# EAGLE design compressor (EAGLE 9.6.2)
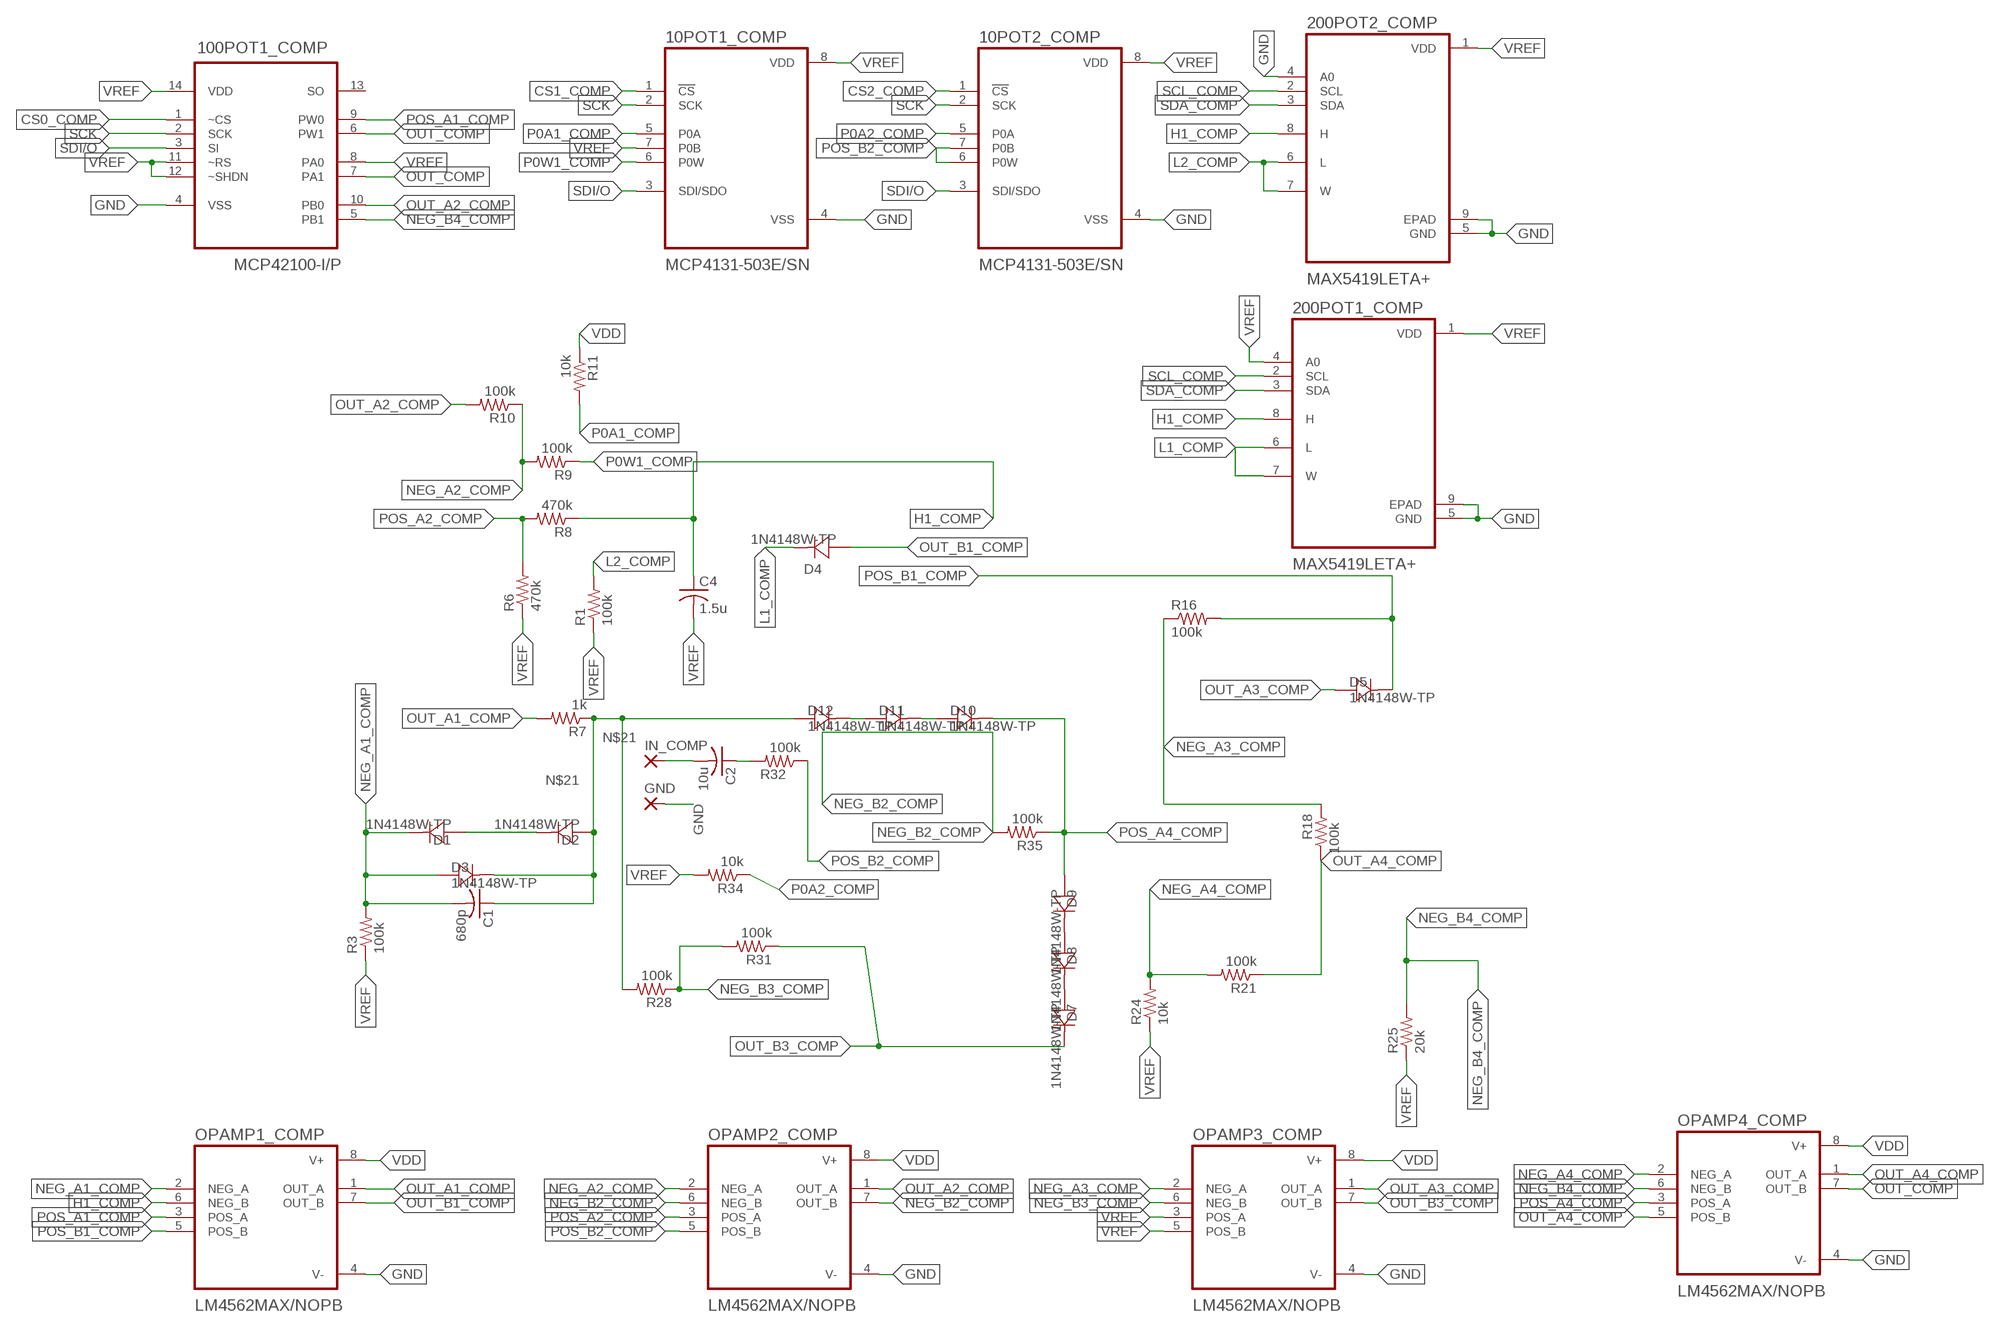
[diagram p0: schematic, sheet 1]

## Parts
10POT1_COMP  MCP4131-503E/SN  [SOIC127P599X175-8N]
10POT2_COMP  MCP4131-503E/SN  [SOIC127P599X175-8N]
100POT1_COMP  MCP42100-I/P  [DIP254P762X432-14]
200POT1_COMP  MAX5419LETA+  [SON65P300X300X80-9N]
200POT2_COMP  MAX5419LETA+  [SON65P300X300X80-9N]
C1  680p  C-USC0402  [C0402]
C2  10u  C-USC0402  [C0402]
C4  1.5u  C-USC0402  [C0402]
D1  1N4148W-TP  [SOD123]
D2  1N4148W-TP  [SOD123]
D3  1N4148W-TP  [SOD123]
D4  1N4148W-TP  [SOD123]
D5  1N4148W-TP  [SOD123]
D7  1N4148W-TP  [SOD123]
D8  1N4148W-TP  [SOD123]
D9  1N4148W-TP  [SOD123]
D10  1N4148W-TP  [SOD123]
D11  1N4148W-TP  [SOD123]
D12  1N4148W-TP  [SOD123]
GND  SMD5  [SMD2,54-5,08]
IN_COMP  SMD5  [SMD2,54-5,08]
OPAMP1_COMP  LM4562MAX/NOPB  [SOIC127P599X175-8N]
OPAMP2_COMP  LM4562MAX/NOPB  [SOIC127P599X175-8N]
OPAMP3_COMP  LM4562MAX/NOPB  [SOIC127P599X175-8N]
OPAMP4_COMP  LM4562MAX/NOPB  [SOIC127P599X175-8N]
R1  100k  R-US_R0402  [R0402]
R3  100k  R-US_R0402  [R0402]
R6  470k  R-US_R0402  [R0402]
R7  1k  R-US_R0402  [R0402]
R8  470k  R-US_R0402  [R0402]
R9  100k  R-US_R0402  [R0402]
R10  100k  R-US_R0402  [R0402]
R11  10k  R-US_R0402  [R0402]
R16  100k  R-US_R0402  [R0402]
R18  100k  R-US_R0402  [R0402]
R21  100k  R-US_R0402  [R0402]
R24  10k  R-US_R0402  [R0402]
R25  20k  R-US_R0402  [R0402]
R28  100k  R-US_R0402  [R0402]
R31  100k  R-US_R0402  [R0402]
R32  100k  R-US_R0402  [R0402]
R34  10k  R-US_R0402  [R0402]
R35  100k  R-US_R0402  [R0402]

## Nets
CS0_COMP: 100POT1_COMP.1(~CS)
CS1_COMP: 10POT1_COMP.1(!CS)
CS2_COMP: 10POT2_COMP.1(!CS)
GND: 10POT1_COMP.4(VSS) 10POT2_COMP.4(VSS) 100POT1_COMP.4(VSS) 200POT1_COMP.5(GND) 200POT1_COMP.9(EPAD) 200POT2_COMP.4(A0) 200POT2_COMP.5(GND) 200POT2_COMP.9(EPAD) GND.1(P) OPAMP1_COMP.4(V-) OPAMP2_COMP.4(V-) OPAMP3_COMP.4(V-) OPAMP4_COMP.4(V-)
H1_COMP: 200POT1_COMP.8(H) 200POT2_COMP.8(H) C4.1 OPAMP1_COMP.6(NEG_B) R8.1
IN_COMP: C2.2 IN_COMP.1(P)
L1_COMP: 200POT1_COMP.6(L) 200POT1_COMP.7(W) D4.C
L2_COMP: 200POT2_COMP.6(L) 200POT2_COMP.7(W) R1.2
N$20: D1.A D2.C
N$21: C1.1 D2.A D3.C D12.A R7.1 R28.2
N$24: D8.A D9.C
N$25: D7.A D8.C
N$30: C2.1 R32.2
N$31: D11.A D12.C
N$32: D10.A D11.C
NEG_A1_COMP: C1.2 D1.C D3.A OPAMP1_COMP.2(NEG_A) R3.2
NEG_A2_COMP: OPAMP2_COMP.2(NEG_A) R9.2 R10.1
NEG_A3_COMP: OPAMP3_COMP.2(NEG_A) R16.1 R18.2
NEG_A4_COMP: OPAMP4_COMP.2(NEG_A) R21.2 R24.2
NEG_B2_COMP: OPAMP2_COMP.6(NEG_B) OPAMP2_COMP.7(OUT_B) R35.2
NEG_B3_COMP: OPAMP3_COMP.6(NEG_B) R28.1 R31.2
NEG_B4_COMP: 100POT1_COMP.5(PB1) OPAMP4_COMP.6(NEG_B) R25.2
OUT_A1_COMP: OPAMP1_COMP.1(OUT_A) R7.2
OUT_A2_COMP: 100POT1_COMP.10(PB0) OPAMP2_COMP.1(OUT_A) R10.2
OUT_A3_COMP: D5.A OPAMP3_COMP.1(OUT_A)
OUT_A4_COMP: OPAMP4_COMP.1(OUT_A) OPAMP4_COMP.5(POS_B) R18.1 R21.1
OUT_B1_COMP: D4.A OPAMP1_COMP.7(OUT_B)
OUT_B3_COMP: D7.C OPAMP3_COMP.7(OUT_B) R31.1
OUT_COMP: 100POT1_COMP.6(PW1) 100POT1_COMP.7(PA1) OPAMP4_COMP.7(OUT_B)
P0A1_COMP: 10POT1_COMP.5(P0A) R11.2
P0A2_COMP: 10POT2_COMP.5(P0A) R34.1
P0W1_COMP: 10POT1_COMP.6(P0W) R9.1
POS_A1_COMP: 100POT1_COMP.9(PW0) OPAMP1_COMP.3(POS_A)
POS_A2_COMP: OPAMP2_COMP.3(POS_A) R6.2 R8.2
POS_A4_COMP: D9.A D10.C OPAMP4_COMP.3(POS_A) R35.1
POS_B1_COMP: D5.C OPAMP1_COMP.5(POS_B) R16.2
POS_B2_COMP: 10POT2_COMP.6(P0W) 10POT2_COMP.7(P0B) OPAMP2_COMP.5(POS_B) R32.1
SCK: 10POT1_COMP.2(SCK) 10POT2_COMP.2(SCK) 100POT1_COMP.2(SCK)
SCL_COMP: 200POT1_COMP.2(SCL) 200POT2_COMP.2(SCL)
SDA_COMP: 200POT1_COMP.3(SDA) 200POT2_COMP.3(SDA)
SDI/O: 10POT1_COMP.3(SDI/SDO) 10POT2_COMP.3(SDI/SDO) 100POT1_COMP.3(SI)
VDD: OPAMP1_COMP.8(V+) OPAMP2_COMP.8(V+) OPAMP3_COMP.8(V+) OPAMP4_COMP.8(V+) R11.1
VREF: 10POT1_COMP.7(P0B) 10POT1_COMP.8(VDD) 10POT2_COMP.8(VDD) 100POT1_COMP.8(PA0) 100POT1_COMP.11(~RS) 100POT1_COMP.12(~SHDN) 100POT1_COMP.14(VDD) 200POT1_COMP.1(VDD) 200POT1_COMP.4(A0) 200POT2_COMP.1(VDD) C4.2 OPAMP3_COMP.3(POS_A) OPAMP3_COMP.5(POS_B) R1.1 R3.1 R6.1 R24.1 R25.1 R34.2
Unconnected: 100POT1_COMP.13(SO)

## Library data of the parts
10POT1_COMP 10POT2_COMP = MCP4131-503E_SN:MCP4131-503E/SN: Check availability <https://pricing.snapeda.com/parts/MCP4131-503E/SN/Microchip/view-part?ref=eda>; AVAILABILITY: In Stock; CHECK_PRICES: https://www.snapeda.com/parts/MCP4131-503E/SN/Microchip/view-part/?ref=eda; DESCRIPTION: MCP4131-503E/SN,Digi Potentiometer 50kOhm 129-Pos Linear Serial-SPI 8-Pin SOIC | Microchip Technology Inc. MCP4131-503E/SN; MF: Microchip; MP: MCP4131-503E/SN; PACKAGE: SOIC-8 Microchip; PRICE: None; PURCHASE-URL: https://www.snapeda.com/api/url_track_click_mouser/?unipart_id=129576&manufacturer=Microchip&part_name=MCP4131-503E/SN&search_term=mcp413; SNAPEDA_LINK: https://www.snapeda.com/parts/MCP4131-503E/SN/Microchip/view-part/?ref=snap
100POT1_COMP = MCP42100-I_P:MCP42100-I/P: Digital Potentiometer Check availability <https://pricing.snapeda.com/parts/MCP42100-I/P/Microchip/view-part?ref=eda>; AVAILABILITY: In Stock; CHECK_PRICES: https://www.snapeda.com/parts/MCP42100-I/P/Microchip/view-part/?ref=eda; DESCRIPTION: Pot,Digital;Rest 100 Kilohms;Digital;256 Pos;14 Pins;2 Ch;Pkg DIP | Microchip Technology Inc. MCP42100-I/P; MF: Microchip; MP: MCP42100-I/P; PACKAGE: DIP-14 Microchip; PRICE: None; PURCHASE-URL: https://www.snapeda.com/api/url_track_click_mouser/?unipart_id=40874&manufacturer=Microchip&part_name=MCP42100-I/P&search_term=mcp42100; SNAPEDA_LINK: https://www.snapeda.com/parts/MCP42100-I/P/Microchip/view-part/?ref=snap
200POT1_COMP 200POT2_COMP = MAX5419LETA_:MAX5419LETA+: Check availability <https://pricing.snapeda.com/parts/MAX5419LETA%2B/Analog%20Devices/view-part?ref=eda>; AVAILABILITY: In Stock; CHECK_PRICES: https://www.snapeda.com/parts/MAX5419LETA+/Analog+Devices/view-part/?ref=eda; DESCRIPTION: 256-Tap, Nonvolatile, I²C-Interface, Digital Potentiometers; MF: Analog Devices; MP: MAX5419LETA+; PACKAGE: TDFN-EP-8 Maxim; PRICE: None; PURCHASE-URL: https://www.snapeda.com/api/url_track_click_mouser/?unipart_id=895758&manufacturer=Analog Devices&part_name=MAX5419LETA+&search_term=max541; SNAPEDA_LINK: https://www.snapeda.com/parts/MAX5419LETA+/Analog+Devices/view-part/?ref=snap
C1 C2 C4 = rcl:C-US: CAPACITOR, American symbol; SPICEPREFIX: C
D1-D5 D7-D12 = 1N4148W-TP:1N4148W-TP: Check availability <https://pricing.snapeda.com/parts/1N4148W-TP/Micro%20Commercial/view-part?ref=eda>; AVAILABILITY: In Stock; CHECK_PRICES: https://www.snapeda.com/parts/1N4148W-TP/Micro+Commercial+Components/view-part/?ref=eda; DESCRIPTION: 1N4148W Series 100 V 150 mA 4 ns SMT High Speed Switching Diode - SOD-123; MF: Micro Commercial; MP: 1N4148W-TP; PACKAGE: SOD-123 Multicomp; PRICE: None; PURCHASE-URL: https://www.snapeda.com/api/url_track_click_mouser/?unipart_id=9224&manufacturer=Micro Commercial&part_name=1N4148W-TP&search_term=1n4148 surface mount; SNAPEDA_LINK: https://www.snapeda.com/parts/1N4148W-TP/Micro+Commercial+Components/view-part/?ref=snap
GND IN_COMP = wirepad:SMD5: SMD PAD
OPAMP1_COMP OPAMP2_COMP OPAMP3_COMP OPAMP4_COMP = LM4562MAX_NOPB:LM4562MAX/NOPB: Check availability <https://pricing.snapeda.com/parts/LM4562MAX/NOPB/Texas%20Instruments/view-part?ref=eda>; AVAILABILITY: In Stock; CHECK_PRICES: https://www.snapeda.com/parts/LM4562MAX/NOPB/Texas+Instruments/view-part/?ref=eda; DESCRIPTION: 2-channel, 55-MHz, high-fidelity, high performance audio op amp; MF: Texas Instruments; MP: LM4562MAX/NOPB; PACKAGE: SOIC-8 Texas Instruments; PRICE: None; PURCHASE-URL: https://www.snapeda.com/api/url_track_click_mouser/?unipart_id=21165&manufacturer=Texas Instruments&part_name=LM4562MAX/NOPB&search_term=lm4562; SNAPEDA_LINK: https://www.snapeda.com/parts/LM4562MAX/NOPB/Texas+Instruments/view-part/?ref=snap
R1 R3 R6-R11 R16 R18 R21 R24 R25 R28 R31 R32 R34 R35 = rcl:R-US_: RESISTOR, American symbol; SPICEPREFIX: R

## Board
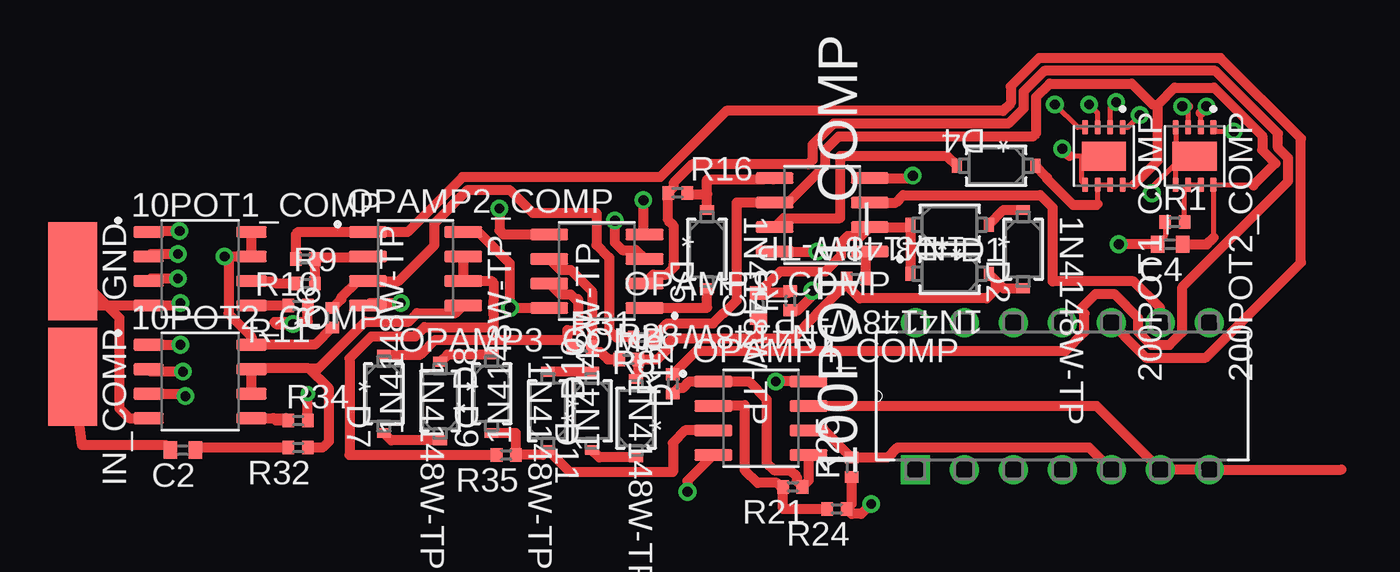
[diagram p1: board, top side]
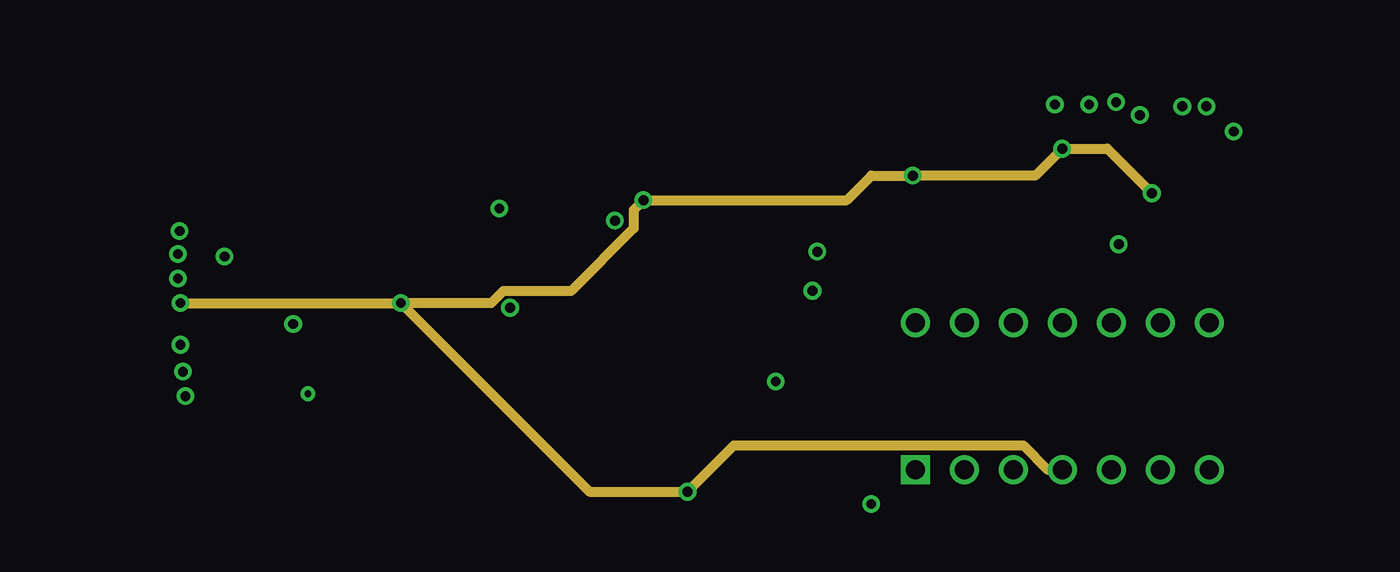
[diagram p2: board, inner layer Route2]
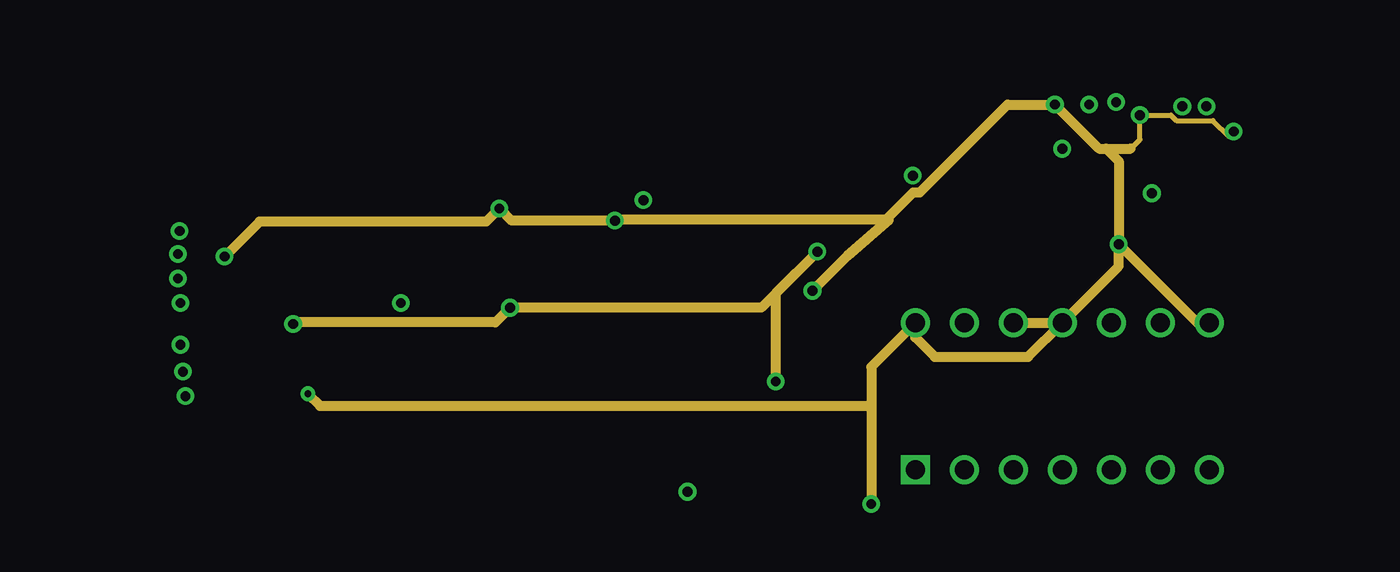
[diagram p3: board, inner layer Route15]
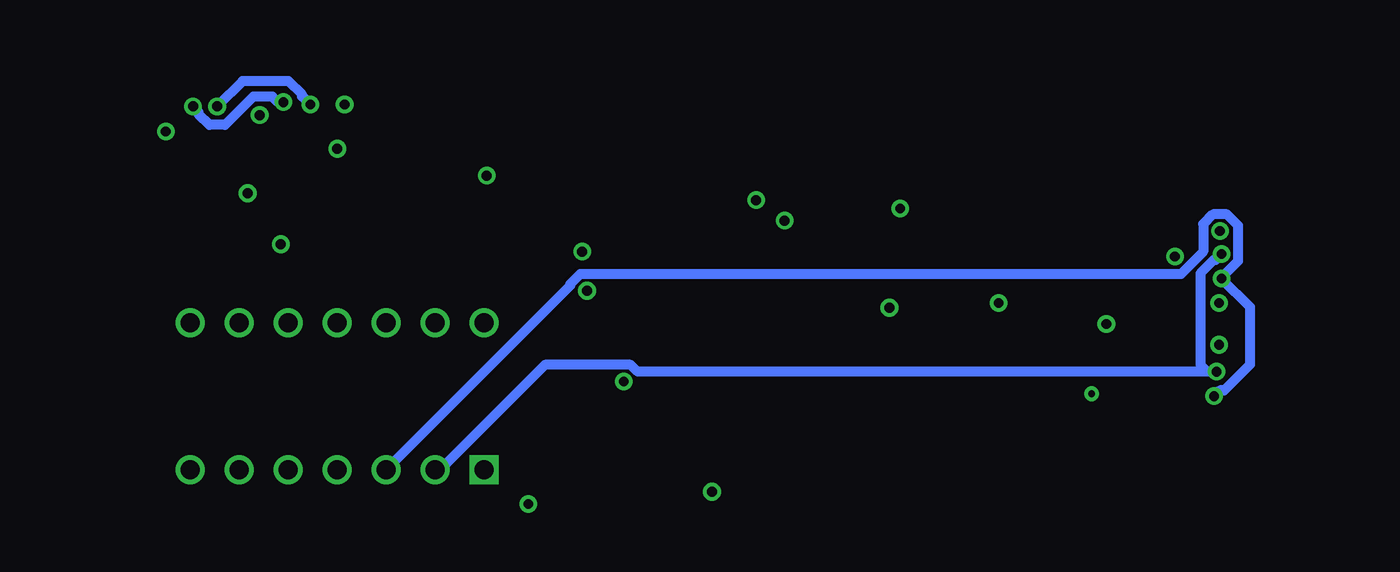
[diagram p4: board, bottom side, seen from below]

No outline drawn. Coordinates in mm, seen from the top.
Copper layers (1+2*15+16): Top 0.035mm / dielectric 1.5mm / Route2 0.035mm / dielectric 0.15mm / Route15 0.035mm / dielectric 0.2mm / Bottom 0.035mm
Design rules "default *": minimum track width 6mil, minimum drill 0.35mm, track to track 6mil, track to pad 6mil, pad to pad 6mil, via to via 6mil, smd to smd 6mil, copper to edge 40mil, drill to drill 6mil, minimum pad ring 10mil, minimum via ring 8mil, stop-mask expansion 4mil, vias tented up to drill 0mil, thermal gap 10mil

### Footprints (pad centres in the part's own frame; a part is rotated, then mirrored left to right if it is on the bottom)
SOIC127P599X175-8N = smd 1.58 x 0.6: 1 -2.67,1.905; 2 -2.67,0.635; 3 -2.67,-0.635; 4 -2.67,-1.905; 5 2.67,-1.905; 6 2.67,-0.635; 7 2.67,0.635; 8 2.67,1.905
DIP254P762X432-14 = drill 0.991 square: 1 -7.62,15.24 | drill 0.991: 2 -7.62,12.7; 3 -7.62,10.16; 4 -7.62,7.62; 5 -7.62,5.08; 6 -7.62,2.54; 7 -7.62,0; 8 0,0; 9 0,2.54; 10 0,5.08; 11 0,7.62; 12 0,10.16; 13 0,12.7; 14 0,15.24
SON65P300X300X80-9N = smd 0.76 x 0.32: 1 -1.485,0.975; 2 -1.485,0.325; 3 -1.485,-0.325; 4 -1.485,-0.975; 5 1.485,-0.975; 6 1.485,-0.325; 7 1.485,0.325; 8 1.485,0.975 | smd 1.5 x 2.3: 9 0,0
C0402 = smd 0.7 x 0.9: 1 -0.65,0; 2 0.65,0
SOD123 = smd 0.508 x 0.711: A 2.032,0; C -2.032,0
SMD2,54-5,08 = smd 2.54 x 5.08: 1 0,0
SOIC127P599X175-8N' = smd 1.97 x 0.6: 1 -2.47,1.905; 2 -2.47,0.635; 3 -2.47,-0.635; 4 -2.47,-1.905; 5 2.47,-1.905; 6 2.47,-0.635; 7 2.47,0.635; 8 2.47,1.905
R0402 = smd 0.6 x 0.7: 1 -0.5,0; 2 0.5,0

### Placement (x,y rotation side)
10POT1_COMP  11.43,17.27 0 top
10POT2_COMP  11.43,11.43 0 top
100POT1_COMP  63.75,14.48 90 top
200POT1_COMP  58.29,23.11 270 top
200POT2_COMP  62.99,23.11 270 top
C1  40.39,15.37 90 top
C2  10.54,7.87 180 top
C4  61.72,18.54 180 top
D1  50.29,19.56 0 top
D2  54.1,18.29 270 top
D3  50.29,17.02 180 top
D4  52.7,22.61 180 top
D5  37.72,18.29 270 top
D7  20.95,10.79 270 top
D8  23.88,10.41 90 top
D9  26.54,10.79 270 top
D10  29.46,9.91 90 top
D11  31.75,9.91 270 top
D12  34.04,9.53 90 top
GND  4.83,17.14 180 top
IN_COMP  4.83,11.68 180 top
OPAMP1_COMP  LM4562MAX/NOPB  [SOIC127P599X175-8N']  43.69,20.07 180 top
OPAMP2_COMP  LM4562MAX/NOPB  [SOIC127P599X175-8N']  22.61,17.27 0 top
OPAMP3_COMP  LM4562MAX/NOPB  [SOIC127P599X175-8N']  32,17.14 180 top
OPAMP4_COMP  LM4562MAX/NOPB  [SOIC127P599X175-8N']  40.51,9.53 0 top
R1  61.98,19.68 0 top
R3  42.04,15.62 90 top
R6  18.29,14.73 90 top
R7  45.47,16.76 0 top
R8  34.42,13.72 180 top
R9  16.89,16.51 0 top
R10  16.89,17.78 180 top
R11  16.51,15.37 180 top
R16  36.2,21.21 0 top
R18  35.94,11.3 90 top
R21  42.16,5.97 180 top
R24  44.45,4.83 180 top
R25  45.21,6.99 90 top
R28  33.66,12.57 0 top
R31  31.24,13.21 0 top
R32  16.51,8 180 top
R34  16.51,9.4 0 top
R35  27.3,7.62 180 top

### Tracks (layer width: path | path; a pad name or v marks a point on that pad's centre or on a via)
CS1_COMP  (via drill 0.51)
  Top 0.508: 10POT1_COMP.1 8.81,19.22 v10.37,19.22
CS2_COMP  (via drill 0.51)
  Top 0.508: 10POT2_COMP.1 v10.41,13.34
GND  (via drill 0.51)
  Top 0.254: 200POT1_COMP.9 57.15,23.11 | 57.15,23.11 56.52,23.11 | 200POT2_COMP.9 62.4,22.52 61.82,22.52 | 61.82,22.52 60.61,21.3 | 200POT2_COMP.4 62.02,22.71 | 62.02,22.71 61.82,22.52 | 200POT2_COMP.5 62.02,22.71 | 200POT1_COMP.5 57.15,21.8 57.15,23.11
  Top 0.508: v10.41,15.49 10.29,15.37 10POT1_COMP.4 5.6,15.37 5.71,15.48 GND.1 7.24,14.73 7.24,10.03 7.74,9.53 10POT2_COMP.4 | OPAMP2_COMP.4 20.26,15.49 v21.84,15.49 | OPAMP4_COMP.4 36.7,6.28 v36.7,5.71 | OPAMP3_COMP.4 34.42,19.11 v34.42,20.83 | v48.39,22.1 48.26,21.97 OPAMP1_COMP.4 | 56.52,23.11 v56.13,23.5 | 60.61,21.3 60.73,21.18 v60.78,21.18
  Route2 0.508: v10.41,15.49 v21.84,15.49 | v21.84,15.49 31.62,5.71 v36.7,5.71 39.1,8.12 54.12,8.12 55.37,6.86 100POT1_COMP.4 | v21.84,15.49 26.52,15.49 27.14,16.12 30.66,16.12 33.91,19.36 33.91,20.32 v34.42,20.83 44.96,20.83 46.23,22.1 v48.39,22.1 54.74,22.1 v56.13,23.5 58.46,23.5 v60.78,21.18
H1_COMP
  Top 0.254: 63.98,18.89 63.98,21.63 | 63.98,21.63 66,21.63 | 200POT2_COMP.8 63.98,21.63 | 200POT1_COMP.8 59.86,21.63
  Top 0.508: R8.1 35.64,14.44 38.03,14.44 38.58,14.99 38.61,14.99 39.24,15.62 39.24,20.7 OPAMP1_COMP.6 41.91,20.7 43.85,22.65 43.85,23.43 44.55,24.13 54.61,24.13 54.79,24.31 54.79,26.18 55.48,26.87 59.74,26.87 60.83,25.79 61.09,25.79 | 66,21.63 66.04,21.59 67.18,22.73 66.5,23.42 66.5,24.17 64.01,26.66 61.96,26.66 61.09,25.79 | 59.86,21.63 61.09,22.86 61.09,25.79 | C4.1 63.64,18.54 63.98,18.89
IN_COMP
  Top 0.508: C2.2 9.64,8.13 5.29,8.13 IN_COMP.1
L1_COMP
  Top 0.254: 57.97,20.63 200POT1_COMP.6 200POT1_COMP.7
  Top 0.508: 57.97,20.63 57.91,20.57 56.7,20.57 55.34,21.93 55.34,22 D4.C
L2_COMP
  Top 0.254: R1.2 62.48,21.44 200POT2_COMP.6 200POT2_COMP.7
N$20
  Top 0.508: D1.A 53.09,20.32 D2.C
N$21
  Top 0.508: 40.39,13.68 35.96,13.68 35.73,13.45 35.73,13.16 35.14,12.57 R28.2 34.16,11.68 D12.A | 40.39,13.68 42.16,13.68 43.45,14.97 43.43,14.99 44.97,16.52 | D2.A 53.09,16.26 D3.C 52.67,16.68 52.67,16.18 52.22,15.73 45.63,15.73 45.16,16.2 45.16,16.33 44.97,16.52 | R7.1 44.97,16.52 | C1.1 40.39,13.68
N$24
  Top 0.508: D9.C 24.26,12.83 D8.A
N$25
  Top 0.508: D8.C 21.34,8.38 D7.A
N$30
  Top 0.508: R32.2 11.32,8 C2.1
N$31
  Top 0.508: D12.C 32.13,7.49 D11.A
N$32
  Top 0.508: D11.C D10.A
NEG_A1_COMP
  Top 0.508: D3.A D1.C 48.13,19.43 OPAMP1_COMP.2 45.7,18.97 45.01,18.97 44.66,18.63 44.66,17.94 43.94,17.21 43.87,17.14 41.51,17.14 C1.2 41.93,16.02 R3.2
NEG_A2_COMP
  Top 0.508: OPAMP2_COMP.2 20.18,17.86 17.47,17.86 R10.1 R9.2
NEG_A3_COMP
  Top 0.508: OPAMP3_COMP.2 34.94,16.97 35.62,16.97 36.04,17.39 35.97,17.46 35.97,19.52 35.7,19.79 R16.1 35.99,21.5 35.99,21.73 36.94,22.68 42.95,22.68 43.19,22.92 43.19,23.7 44.28,24.79 53.34,24.79 54.13,25.58 54.13,26.45 55.21,27.53 64.07,27.53 67.31,24.29 67.31,23.54 67.84,23.01 67.84,21.81 62.37,16.34 62.37,14 61.69,13.32 60.73,13.32 60.06,14 60.06,14.73 58.82,15.96 57.87,15.96 57.15,15.24 57.15,15.1 57.29,14.96 57.29,14 56.31,13.02 37.16,13.02 R18.2
NEG_A4_COMP
  Top 0.508: R24.2 41.66,4.83 R21.2 41.54,5.97 41.34,6.17 40.33,6.17 39.66,6.84 39.66,10.21 38.09,10.21 OPAMP4_COMP.2
NEG_B2_COMP
  Top 0.508: R35.2 19.18,7.62 19.18,12.62 20.32,13.77 22.59,13.77 23.07,14.25 26.67,14.25 26.67,14.86 26.64,14.89 26.64,15.61 26.67,15.64 26.67,16.51 26.54,16.64 OPAMP2_COMP.6 OPAMP2_COMP.7
NEG_B3_COMP
  Top 0.508: R28.1 32.57,12.57 32.32,12.83 32.19,12.95 32,12.95 R31.2 31.74,16.12 30.64,17.22 30.1,17.22 OPAMP3_COMP.6
NEG_B4_COMP
  Top 0.508: 100POT1_COMP.5 57.52,8.01 47.6,8.01 47.07,7.49 R25.2 43.81,8.89 OPAMP4_COMP.6
OUT_A1_COMP
  Top 0.508: R7.2 45.97,17.97 OPAMP1_COMP.1
OUT_A2_COMP
  Top 0.508: 100POT1_COMP.10 59.4,13.75 59.4,13.73 60.46,12.66 63.57,12.66 68.5,17.59 68.5,24.03 64.34,28.19 54.93,28.19 53.47,26.73 53.47,25.85 53.07,25.45 38.71,25.45 35.29,22.02 25.03,22.02 22.18,19.18 OPAMP2_COMP.1 16.52,19.18 16.39,19.05 R10.2
OUT_A3_COMP
  Top 0.508: OPAMP3_COMP.1 37.68,15.24 37.72,15.28 D5.A
OUT_A4_COMP
  Top 0.508: OPAMP4_COMP.5 42.98,6.29 R21.1 42.37,6.26 42.37,6.49 42.03,6.83 41.18,6.83 40.81,7.2 40.81,10.5 39.88,11.43 OPAMP4_COMP.1 36.79,11.43 36.46,11.1 36.23,11.1 R18.1
OUT_B1_COMP
  Top 0.508: D4.A 50.16,23.11 44.62,23.11 44.62,19.89 41.68,19.89 OPAMP1_COMP.7
OUT_B3_COMP
  Top 0.508: D7.C 22.86,12.83 23.62,13.59 30.48,13.59 | R31.1 30.48,13.47 30.48,13.59 | 30.48,13.59 30.48,14.1 31.03,14.1 31.03,15.71 30.88,15.71 30.64,15.95 30.1,15.95 OPAMP3_COMP.7
OUT_COMP
  Top 0.508: OPAMP4_COMP.7 57.91,10.16 100POT1_COMP.6 100POT1_COMP.7 70.61,6.86
P0A1_COMP
  Top 0.508: R11.2 10POT1_COMP.5
P0A2_COMP
  Top 0.508: 10POT2_COMP.5 15.24,9.53 | 15.24,9.53 15.88,9.53 | R34.1 15.37,9.4 15.24,9.53
P0W1_COMP
  Top 0.508: R9.1 15.38,16.51 15.25,16.64 10POT1_COMP.6
POS_A1_COMP
  Top 0.508: 100POT1_COMP.9 61.21,15.24 59.83,16.62 55.63,16.62 55.63,20.45 54.99,21.08 47.88,21.08 47.5,20.7 OPAMP1_COMP.3
POS_A2_COMP
  Top 0.508: R6.2 18.75,15.69 18.75,15.79 19.59,16.64 OPAMP2_COMP.3 21.72,16.64 23.58,18.5 23.58,19.64 25.3,21.36 27.47,21.36 28.67,20.16 31.98,20.16 31.98,18.51 32.64,17.85 32.64,14.1 33.02,13.72 R8.2
POS_A4_COMP
  Top 0.508: D9.A 27.8,8.76 R35.1 29.21,7.62 D10.C 30.61,6.73 35.94,6.73 35.94,8.25 36.58,8.89 OPAMP4_COMP.3
POS_B1_COMP
  Top 0.508: D5.C 37.72,21.14 | 37.72,21.14 37.72,21.9 40.64,21.9 41.15,21.9 OPAMP1_COMP.5 | 37.72,21.14 36.68,21.14 R16.2
POS_B2_COMP
  Top 0.508: 17.07,12.11 18.11,11.07 18.11,8.33 17.78,8 R32.1 | 17.07,12.11 14.15,12.11 10POT2_COMP.7 10POT2_COMP.6 | 17.07,12.11 17.57,12.11 19.99,14.53 22.24,14.53 22.68,14.97 24.68,14.97 OPAMP2_COMP.5
SCK  (via drill 0.51)
  Top 0.508: v10.29,18.03 8.89,18.03 10POT1_COMP.2 | 10POT2_COMP.2 8.89,11.94 v10.54,11.94
  Bottom 0.508: 100POT1_COMP.2 50.8,6.86 45.36,12.29 40.92,12.29 40.56,11.94 v10.54,11.94 11.02,11.94 11.38,12.3 11.38,17.04 10.69,17.73 10.59,17.73 v10.29,18.03
SCL_COMP  (via drill 0.51)
  Top 0.254: 200POT1_COMP.2 58.62,25.6 v58.93,25.91 | 200POT2_COMP.2 63.32,25.34
  Top 0.508: 63.32,25.34 63.63,25.65 63.63,25.67 v63.61,25.69
  Bottom 0.508: v58.93,25.91 59.22,25.91 59.5,26.19 60.49,26.19 61.96,24.73 62.76,24.73 63.32,25.29 63.32,25.4 v63.61,25.69
SDA_COMP  (via drill 0.51)
  Top 0.254: v57.53,25.78 57.97,25.34 200POT1_COMP.3 | 200POT2_COMP.3 62.67,25.69
  Top 0.508: v62.36,25.69 62.67,25.69
  Bottom 0.508: v57.53,25.78 57.96,26.21 57.96,26.31 58.66,27 61.05,27 v62.36,25.69
SDI/O  (via drill 0.51)
  Top 0.508: 10POT1_COMP.3 8.89,16.76 v10.29,16.76 | v10.67,10.67 10.54,10.79 10POT2_COMP.3
  Bottom 0.508: v10.67,10.67 10.36,10.97 10.14,10.97 8.81,12.3 8.81,15.29 v10.29,16.76 10.29,16.81 9.42,17.68 9.42,19.5 10.01,20.09 10.72,20.09 11.23,19.58 11.23,18.16 12.39,17 43.54,17 44.05,16.49 44.05,16.41 100POT1_COMP.3
VDD  (via drill 0.51)
  Top 0.508: OPAMP4_COMP.8 v41.27,11.43 | OPAMP1_COMP.8 v43.43,18.16 | R11.1 17.01,14.54 16.8,14.54 16.77,14.51 15.27,14.51 15.38,14.41 v16.26,14.41 | OPAMP2_COMP.8 25.86,19.18 27.5,17.54 v27.5,15.25 29.52,15.25 OPAMP3_COMP.8
  Route15 0.508: v41.27,11.43 41.27,16 v43.43,18.16 40.53,15.25 v27.5,15.25 26.74,14.49 16.26,14.49 v16.26,14.41
VREF  (via drill 0.35, 0.51)
  Top 0.254: R1.1 61.48,18.95 C4.2 | 200POT1_COMP.1 59.52,24.6 v60.16,25.23 | v65.02,24.38 64.18,24.38 200POT2_COMP.1 | 200POT1_COMP.4 56.94,24.6 v55.75,25.78
  Top 0.508: v46.23,5.08 45.72,4.57 45.2,4.57 R24.1 45.21,5.09 R25.1 | R34.2 v17.01,10.79 v17.02,10.79 | v32.94,19.76 32.94,18.62 33.32,18.24 34.01,18.24 OPAMP3_COMP.3 | R3.1 42.42,15.12 43.18,15.88 v43.18,16.13 | v26.95,20.4 26.95,19.26 27.15,19.05 OPAMP3_COMP.5 | C4.2 v59.06,18.54 | 10POT1_COMP.8 10POT1_COMP.7 v12.7,17.91 12.9,17.7 12.9,14.94 14.1,13.75 10POT2_COMP.8 17.39,13.34 R6.1
  Route15 0.254: v65.02,24.38 64.77,24.13 63.95,24.95 62.05,24.95 61.77,25.23 v60.16,25.23 60.16,23.96 59.69,23.5
  Route15 0.508: v12.7,17.91 14.51,19.71 26.26,19.71 v26.95,20.4 27.58,19.76 v32.94,19.76 32.99,19.81 46.99,19.81 | v43.18,16.13 44.96,17.91 47.13,19.81 46.99,19.81 | v59.06,18.54 63.13,14.48 100POT1_COMP.8 | 58.42,23.5 58.04,23.5 v55.75,25.78 53.29,25.78 48.74,21.23 48.41,21.23 46.99,19.81 | 58.42,23.5 59.69,23.5 | 58.42,23.5 59.06,22.85 v59.06,18.54 | 100POT1_COMP.11 59.06,17.41 v59.06,18.54 | 100POT1_COMP.11 54.36,12.7 49.53,12.7 48.51,13.72 100POT1_COMP.14 46.23,12.19 46.23,10.16 | 100POT1_COMP.12 100POT1_COMP.11 | v17.02,10.79 17.65,10.16 46.23,10.16 | 46.23,10.16 v46.23,5.08